# Altium schematic sheet FRU_Programmer.SchDoc: Microcontroller with power supply and interfaces
size A4; Date: 02.03.2021; DrawnBy: PFH; Engineer: PFH; Revision: B; SheetNumber: 1; SheetTotal: 2; Projekt: FRU Programmer for FPGA mezzanine cards (FMC); Website: www.fmchub.com
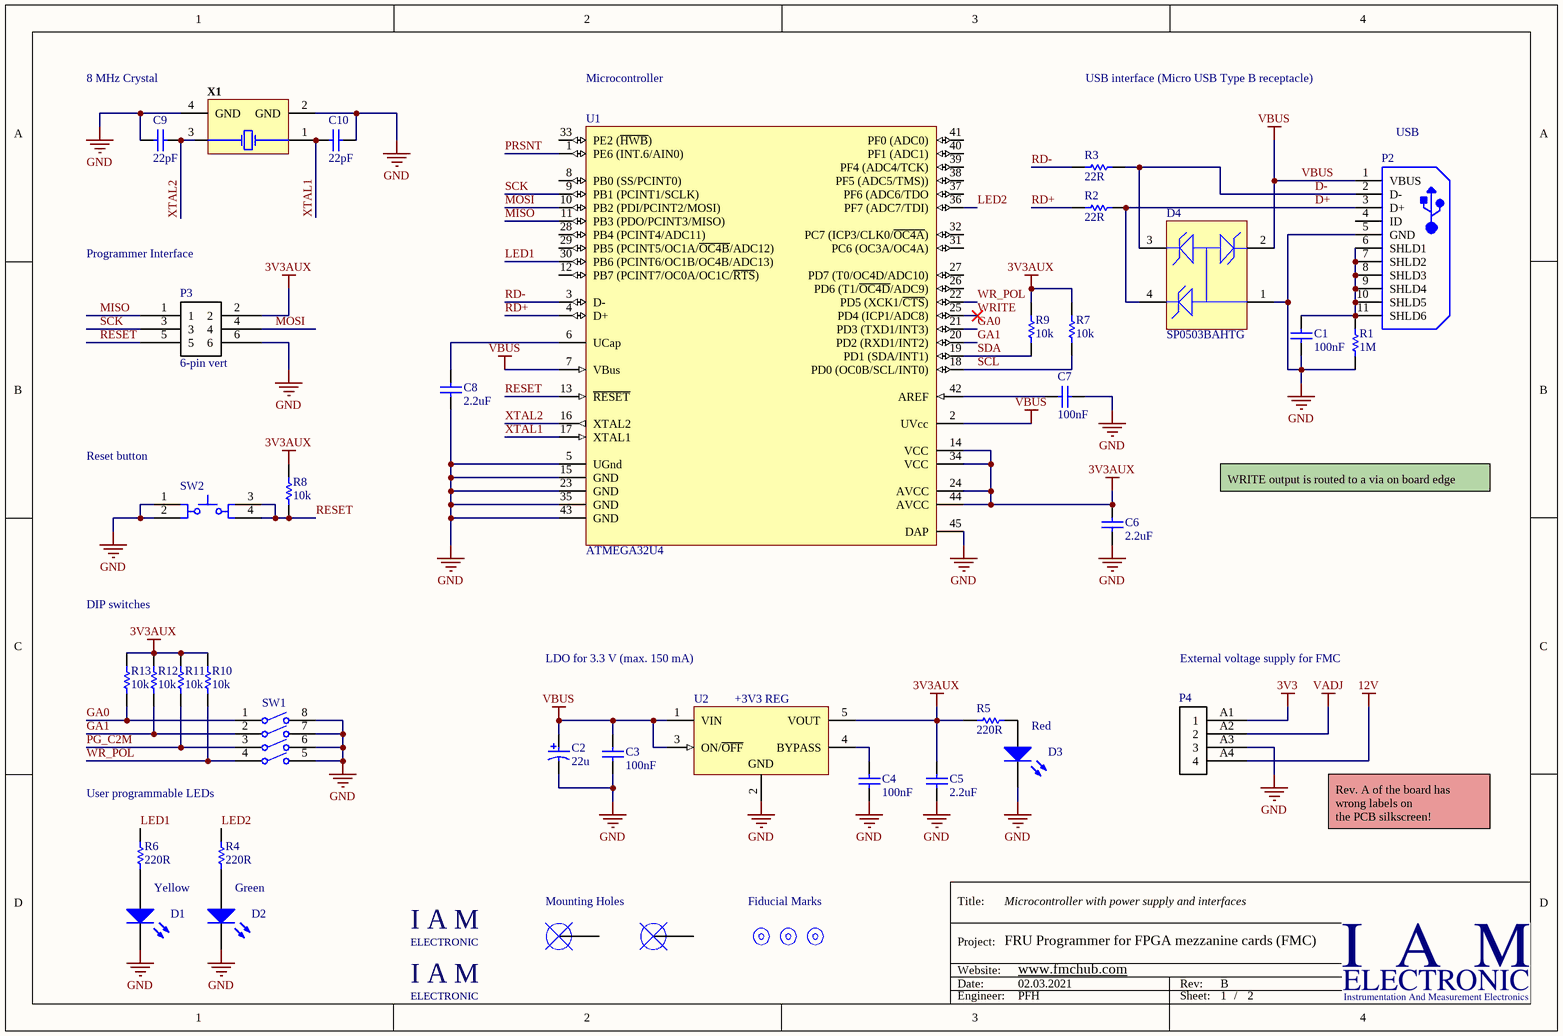
[diagram p0: FRU_Programmer.SchDoc]

## Parts
C1  100nF  [CAPC0603(1608)100_L]
C2  22u  [AVX-TAJ-B-2_L]
C3  100nF  [CAPC0603(1608)100_L]
C4  100nF  [CAPC0603(1608)100_L]
C5  2.2uF  [CAPC0603(1608)100_L]
C6  2.2uF  [CAPC0603(1608)100_L]
C7  100nF  [CAPC0603(1608)100_L]
C8  2.2uF  [CAPC0603(1608)100_L]
C9  22pF  [CAPC0603(1608)100_L]
C10  22pF  [CAPC0603(1608)100_L]
D1  LED Yellow  [0603_A]  (value not drawn)
D2  LED Green  [0603_A]  (value not drawn)
D3  LED Red  [0603_A]  (value not drawn)
D4  SP0503BAHTG  [LFUS-SOT143-4_V]
FM1  1mm  [FIDUCIAL_MARK_ROUND_RING]  (value not drawn)  (no BOM)
FM2  1mm  [FIDUCIAL_MARK_ROUND_RING]  (value not drawn)  (no BOM)
FM3  1mm  [FIDUCIAL_MARK_ROUND_RING]  (value not drawn)  (no BOM)
MH1  2.7mm  [Mounting_Hole_Plated_2.7mm-COVERED]  (value not drawn)  (no BOM)
MH2  2.7mm  [Mounting_Hole_Plated_2.7mm-COVERED]  (value not drawn)  (no BOM)
P2  USB Jack  [FCI-10118193-0001LF-5_V]  (value not drawn)
P3  6-pin vert  [TSM-103-01-T-DV]
P4  PTSM SMT connector  [PTSM-4pol]  (value not drawn)
R1  1M  [RESC1608X55X25NL10T15]
R2  22R  [RESC0603(1608)_L]
R3  22R  [RESC0603(1608)_L]
R4  220R  [RESC1608X55X25NL10T15]
R5  220R  [RESC1608X55X25NL10T15]
R6  220R  [RESC1608X55X25NL10T15]
R7  10k  [RESC1608X55X25NL10T15]
R8  10k  [RESC1608X55X25NL10T15]
R9  10k  [RESC1608X55X25NL10T15]
R10  10k  [RESC1608X55X25NL10T15]
R11  10k  [RESC1608X55X25NL10T15]
R12  10k  [RESC1608X55X25NL10T15]
R13  10k  [RESC1608X55X25NL10T15]
STR1  IAM LOGO  [IAM LOGO - MEDIUM - WWW]  (value not drawn)  (no BOM)
STR2  IAM LOGO  [IAM LOGO - LARGE - WWW]  (value not drawn)  (no BOM)
SW1  DIP switch  [218-4LPST]  (value not drawn)
SW2  Push switch  [ESWI-TL3342F160QG_V]  (value not drawn)
U1  ATMEGA32U4  [44PW_M]
U2  LP2985-33  [DBV0005A_M]  (value not drawn)
X1  8 MHz  [ABRA-ABM3B_V]  (value not drawn)

## Nets
3V3: P4.A1(1)
3V3AUX: C5.1 C6.1 P3.2 R5.2 R7.2 R8.1 R9.2 R10.1 R11.1 R12.1 R13.1 U1.14(VCC) U1.24(AVCC) U1.34(VCC) U1.44(AVCC) U2.5(VOUT)
12V: P4.A4(4)
GND: C1.2 C2.2 C3.2 C4.2 C5.2 C6.2 C7.2 C8.2 C9.1 C10.2 D1.1(K) D2.1(K) D3.1(K) D4.1 P2.5(GND) P3.6 P4.A3(3) R1.1 SW1.5 SW1.6 SW1.7 SW1.8 SW2.1 SW2.2 U1.5(UGnd) U1.15(GND) U1.23(GND) U1.35(GND) U1.43(GND) U1.45(DAP) U2.2(GND) X1.2(GND) X1.4(GND)
VADJ: P4.A2(2)
VBUS: C2.1 C3.1 D4.2 P2.1(VBUS) U1.2(UVcc) U1.7(VBus) U2.1(VIN) U2.3(ON/~{OFF})
D+: D4.4 P2.3(D+) R2.2
D-: D4.3 P2.2(D-) R3.2
GA0: R13.2 SW1.1 U1.21(PD3_(TXD1/INT3))
GA1: R12.2 SW1.2 U1.20(PD2_(RXD1/INT2))
LED1: R6.2 U1.30(PB6_(PCINT6/OC1B/OC4B/ADC13))
LED2: R4.2 U1.36(PF7_(ADC7/TDI))
MISO: P3.1 U1.11(PB3_(PDO/PCINT3/MISO))
MOSI: P3.4 U1.10(PB2_(PDI/PCINT2/MOSI))
PG_C2M: R11.2 SW1.3
PRSNT: U1.1(PE6_(INT.6/AIN0))
RD+: R2.1 U1.4(D+)
RD-: R3.1 U1.3(D-)
RESET: P3.5 R8.2 SW2.3 SW2.4 U1.13(~{RESET})
SCK: P3.3 U1.9(PB1_(PCINT1/SCLK))
SCL: R7.1 U1.18(PD0_(OC0B/SCL/INT0))
SDA: R9.1 U1.19(PD1_(SDA/INT1))
WR_POL: R10.2 SW1.4 U1.22(PD5_(XCK1/~{CTS}))
WRITE: U1.25(PD4_(ICP1/ADC8))
XTAL1: C10.1 U1.17(XTAL1) X1.1(X1)
XTAL2: C9.2 U1.16(XTAL2) X1.3(X2)
NetC1_1: C1.1 P2.6(SHLD1) P2.7(SHLD2) P2.8(SHLD3) P2.9(SHLD4) P2.10(SHLD5) P2.11(SHLD6) R1.2
NetC4_1: C4.1 U2.4(BYPASS)
NetC7_1: C7.1 U1.42(AREF)
NetC8_1: C8.1 U1.6(UCap)
NetD1_2: D1.2(A) R6.1
NetD2_2: D2.2(A) R4.1
NetD3_2: D3.2(A) R5.1

Not connected (* = marked no-connect by the designer): FM1 FD0; FM2 FD0; FM3 FD0; MH1 0; MH2 0; P2 4(ID); U1 8(PB0_(SS/PCINT0)) 12(PB7_(PCINT7/OC0A/OC1C/~{RTS})) 26(PD6_(T1/~{OC4D}/ADC9)) 27(PD7_(T0/OC4D/ADC10)) 28(PB4_(PCINT4/ADC11)) 29(PB5_(PCINT5/OC1A/~{OC4B}/ADC12)) 31(PC6_(OC3A/OC4A)) 32(PC7_(ICP3/CLK0/~{OC4A})) 33(PE2_(~{HWB})) 37(PF6_(ADC6/TDO) 38(PF5_(ADC5/TMS))) 39(PF4_(ADC4/TCK)) 40(PF1_(ADC1)) 41(PF0_(ADC0))

## Notes on the sheet
- 8 MHz Crystal
- Microcontroller
- USB interface (Micro USB Type B receptacle)
- (near P2) USB
- Programmer Interface
- (near SW2) Reset button
- WRITE output is routed to a via on board edge
- DIP switches
- LDO for 3.3 V (max. 150 mA)
- (near U2) +3V3 REG
- External voltage supply for FMC
- Red
- User programmable LEDs
- Rev. A of the board has
  wrong labels on
  the PCB silkscreen!
- Yellow
- Green
- Mounting Holes
- Fiducial Marks
- Title:
- Project:
- Date:
- Website:
- Rev:
- Engineer:
- Sheet:
- /
- (in symbol IAM_LOGO) I A M; ELECTRONIC

## Library data of the parts
C1 C3 C7 = CMP-1035-02591-1: CAP 100nF, 0603 (1608 Metric); Part: C0603C104M4RAC7411; Manufacturer: KEMET; Rated Voltage: 50 V; Tolerance: Â±5%; Case-Metric: 1608; Case-EIA: 0603; Max Thickness: 1 mm; Technology: SMT; Value: 100nF
C2 = CMP-2100-03689-1: Standard Tantalum, 22 uF, +/- 10%, 16 V, -55 to 125 degC, 2-Pin SMD (1210), RoHS, Tape and Reel; Manufacturer: AVX; Part: TAJB226K016RNJ; Leakage Current: 3.5uA; Dissipation Factor: 6%; Voltage Rating (DC): 16V; Capacitance: 22uF; ESR (Equivalent Series Resistance): 2.3Ohm; Polarity: Polar; Package Quantity: 1; Tolerance: 10%; Number of Pins: 2; Manufacturer URL: http://www.avx.com/; Height - Seated (Max): 0.083inch; Case Code (Imperial): 1210; Package Reference: TAJ-B-2; Height: 1.9mm; Depth: 2.8mm; Packaging: TapeandReel; Termination: SMD/SMT; Case/Package: 1210; Lead Free: LeadFree; Min Operating Temperature: -55degC; RoHSCompliant: True; Dielectric Material: Tantalum; Case Code (Metric): 3528; Width: 2.8mm; Datasheet URL: http://datasheets.avx.com/TAJ.pdf; Radiation Hardening: No; Package Description: 2-Pin Surface Mount Device, Body 3.5 x 2.85 mm; Length: 3.5mm; Voltage Rating: 16V; Datasheet Version: 42401.0; Max Operating Temperature: 125degC; REACH SVHC: NoSVHC; Voltage: 16V
C4 = CMP-1035-02591-1: CAP 100nF, 0603 (1608 Metric); Manufacturer: KEMET; Part: C0603C104M4RAC7411; Rated Voltage: 50 V; Tolerance: Â±5%; Case-Metric: 1608; Case-EIA: 0603; Max Thickness: 1 mm; Technology: SMT; Value: 100nF
C5 C6 = CMP-1035-02591-1: CAP 2.2uF, 0603 (1608 Metric); Part: C0603C225K4PACTU; Manufacturer: KEMET; Rated Voltage: 50 V; Tolerance: Â±5%; Case-Metric: 1608; Case-EIA: 0603; Value: 100nF; Max Thickness: 1 mm; Technology: SMT
C8 = CMP-1035-02591-1: CAP 2.2uF, 0603 (1608 Metric); Manufacturer: KEMET; Part: C0603C225K4PACTU; Rated Voltage: 50 V; Tolerance: Â±5%; Case-Metric: 1608; Case-EIA: 0603; Value: 100nF; Max Thickness: 1 mm; Technology: SMT
C9 C10 = CMP-1035-02591-1: CAP 22pF, 0603 (1608 Metric); Part: CC0603JRNPO9BN220; Manufacturer: Yageo; Rated Voltage: 50 V; Tolerance: Â±5%; Case-Metric: 1608; Case-EIA: 0603; Value: 100nF; Max Thickness: 1 mm; Technology: SMT; Manufacturer2: KEMET; Part2: CBR06C220J5GAC
D1 = CMP-1426-00006-1: LED 0603, 2V, Yellow; PartNumber: 150060YS75000; Manufacturer: Wuerth Elektronik; ComponentLink2URL: http://katalog.we-online.com/led/datasheet/150060VS75000.pdf; ComponentLink1Description: Manufacturer URL; PackageReference: 0603_A; ComponentLink2Description: Datasheet; ComponentLink1URL: http://www.we-online.com; Color: Yellow; Part: 150060YS75000
D2 = CMP-1426-00006-1: LED 0603, 2V, Green; PartNumber: 150060VS75000; Manufacturer: Wuerth Elektronik; Color: Bright Green; ComponentLink2URL: http://katalog.we-online.com/led/datasheet/150060VS75000.pdf; ComponentLink1Description: Manufacturer URL; PackageReference: 0603_A; ComponentLink2Description: Datasheet; ComponentLink1URL: http://www.we-online.com; Part: 150060VS75000
D3 = CMP-1426-00006-1: LED 0603, 2V, Red; PartNumber: 150060RS75000; Manufacturer: Wuerth Elektronik; ComponentLink2URL: http://katalog.we-online.com/led/datasheet/150060VS75000.pdf; ComponentLink1Description: Manufacturer URL; PackageReference: 0603_A; ComponentLink2Description: Datasheet; ComponentLink1URL: http://www.we-online.com; Color: Red; Part: 150060RS75000
D4 = CMP-2000-05191-1: TVS Diode Array, 30 pF, 30 KV, -40 to 85 degC, 4-Pin SOT143, RoHS, Tape and Reel; Manufacturer: Littelfuse; Direction Type: Uni-Directional; Product Height (mm): 1.05mm; Leakage Current (Max): 0.1uA; Clamping Voltage (Max): 8V; Reverse Stand-off Voltage: 5.5(Min)V; Configuration: Triple; Working Voltage: 5.5V; Product Length (mm): 3.04mm; Working Voltage (Max): 5.5V(Min); Capacitance Value: 30pF; Rad Hardened: No; Number of Elements: 3; Product Depth (mm): 1.4mm; Operating Temperature Max Deg. C: 85C; Suppressor Type: TVS; Operating Temperature Min Deg. C: -40C; Operating Temp Range: -40Cto85C; Mounting: SurfaceMount; Package / Case: SOT-143; Datasheet Version: Dec-13; Package Type: SOT-143; Packaging: TapeandReel; Pin Count: 3+Tab; Operating Temperature Classification: Industrial; Datasheet URL: https://datasheet.ciiva.com/15143/getdatasheetpartid-116020-15143550.pdf; Manufacturer URL: http://www.littelfuse.com/; Leakage Current: 0.1uA; Mounting Style: SurfaceMount; Clamping Voltage: 8V; Polarity: Uni-Directional; Part: SP0503BAHTG
FM1-FM3 = Fiducial_Mark: Fiducial mark, width 1mm, clearance 3mm; Width: 1 mm; Clearance: 3 mm
MH1 MH2 = Mounting_Hole_2.7mm: Mounting hole, hole size 2.7mm; Hole radius: 2.7 mm; Diameter (plated): *; Keep out (radius): *; Plated: *
P2 = CMP-2000-05119-1: Micro USB B Type Receptacle, -55 to 85 degC, 5-Pin SMD, RoHS, Tape and Reel; Manufacturer: FCI; Part: 10118193-0001LF; Insulation Resistance: 1000MOhms; Gender: Female; Current Rating: 1.8A; Number of Contacts: 5Contact; Connector Type: MicroUSBTypeBreceptacle; Mounting Angle: Right; Datasheet Version: Rev. C, 05/2015; Packaging: Reel; Product Category: USBConnectors; Standard: USB2.0; Factory Pack Quantity: 1200; Operating Temperature Range: -55Cto+85C; Termination Style: SMD/SMT; Datasheet URL: http://datasheet.octopart.com/10118193-0001LF-FCI-datasheet-55953155.pdf; Contact Material: CopperAlloy; RoHS: Details; Contact Plating: Gold; Flammability Rating: UL94V-0; Manufacturer URL: http://www.fci.com/; Brand: FCI; Product: MicroUSBTypeBConnectors; Color: Black
P3 = TSM-103-01-T-DV: .100" (2.54 mm) pitch 6 pin (dual row) header, 0.38" (9.65 mm) total height, SMT; Manufacturer: Samtec; Part: TSM-103-01-T-DV
P4 = PC-PTSM-4pol: Phoenix Contact PTSM SMT connector; Part: 1814650; Manufacturer: Phoenix Contact
R1 = CMP-2000-05022-1: Resistor, 1 MOhm, 0603 (1608 Metric); Manufacturer: Yageo; Part: RC0603JR-071ML; Resistance: 10kOhms; Voltage Rating: 50V; Temperature Coefficient: 100PPM/C; Power Rating: 100mW; Tolerance: 5%; Package Reference: 603; Series: RC; Case Code - mm: 1608; Packaging: Reel; Datasheet URL: http://www.farnell.com/datasheets/443971.pdf; Datasheet Version: Rev. 4, 04/2009; Operating Temperature Range: -55Cto+155C; Product: ThickFilmResistorsGeneralPurpose; Package Description: 2-Pin Surface Mount Device, Body 1.6 x 0.8 mm; Manufacturer URL: http://www.yageo.com/; Case Code - in: 0603; Termination Style: SMD/SMT
R2 R3 = CMP-1012-00034-1: 22R 0.1W 5% 0603 (1608 Metric)  SMD; Part: RC0603FR-0722RL; Manufacturer: Yageo; Value: 22.00 Ohm; Case-EIA: 0603; Case-Metric: 1608; Technology: SMT; Power: 0.1 W; Tolerance: 5 %
R4-R6 = CMP-1659-00018-1: Resistors, 220 Ohm, +/- 1%, 0603 (1608 Metric); Part: RC0603FR-07220RL; Manufacturer: Yageo; ComponentLink1URL: http://www.yageo.com/; ComponentLink1Description: Manufacturer URL; PackageDescription: 2-Pin Surface Mount Device, Body 1.6 x 0.8 mm; RoHSCompliant: false; ComponentLink2Description: Datasheet; DatasheetVersion: Rev. 4, 04/2009; PackageReference: 0603; ComponentLink2URL: https://datasheet.ciiva.com/11808/0900766b80f96399-11808136.pdf
R7-R13 = CMP-2000-05022-1: Resistor, 10 KOhm, 0603 (1608 Metric); Manufacturer: Walsin; Part: WR06X1002FTL; Resistance: 10kOhms; Voltage Rating: 50V; Temperature Coefficient: 100PPM/C; Power Rating: 100mW; Tolerance: 5%; Package Reference: 603; Series: RC; Case Code - mm: 1608; Packaging: Reel; Datasheet URL: http://www.farnell.com/datasheets/443971.pdf; Datasheet Version: Rev. 4, 04/2009; Operating Temperature Range: -55Cto+155C; Product: ThickFilmResistorsGeneralPurpose; Package Description: 2-Pin Surface Mount Device, Body 1.6 x 0.8 mm; Manufacturer URL: http://www.yageo.com/; Case Code - in: 0603; Termination Style: SMD/SMT
STR1 STR2 = IAM_LOGO: I A M E L E C T R O N I C - Logo; Layer: Top Overlay; Manufacturer: IAM ELECTRONIC; Part: Logo
SW1 = 218-4LPST: 4 channel DIP switch; Manufacturer: CTS Electronic Components; Part: 218-4LPST
SW2 = CMP-1696-00003-1: Switch, Tactile, SPST-NO, 50 mA, 12 V, 4-Pin SMD, RoHS, Tape and Reel; Part: TL3342F160QG; Manufacturer: E-Switch; Voltage Rating (DC): 50 V; Tolerance: 20%; Case\Package: Radial; Capacitance: 4.7 uF; Max Operating Temperature: 85 degC; REACH SVHC: No SVHC; Package Quantity: 200; Voltage Rating: 50 V; ComponentLink1Description: Manufacturer URL; ComponentLink2URL: http://spec_sheets.e-switch.com/specs/P010632.pdf; ComponentLink2Description: Datasheet; Height: 11 mm; Lead Pitch: 2 mm; RoHSCompliant: true; Radiation Hardening: No; Pins: 2; Length: 11 mm; DatasheetVersion: Rev. I, 12/2010; PackageReference: TL3342F160QG; ComponentLink1URL: http://www.e-switch.ch/en/; PackageDescription: 4-Pin Surface Mount Device, Body 5 x 5 mm, Pitch 6.3 mm; Mount: Through Hole; Diameter: 5 mm; Packaging: Bulk; Min Operating Temperature: -40 degC; Width: 0 inch
U1 = CMP-0095-00166-2: 8-bit AVR Microcontroller, 2.7-5.5V, 16MHz, 32KB Flash, 1KB EEPROM, 2.5KB SRAM, USB Controller, 44-pin QFN, Industrial Grade (-40°C to 85°C), Ext Osc; Part: ATMEGA32U4-MU; Manufacturer: Microchip; PackageVersion: revG, Sep-2009; PackageReference: 44PW; ComponentLink1URL: http://www.atmel.com/; PackageDescription: 44-Pin Quad Flat No-Lead Package, 7 x 7 mm Body, 0.5 mm Pitch (QFN); ComponentLink3Description: ATmega16U4 ATmega32U4 Summary; RevisionNote: DatasheetVersion, PackageVersion & PCB updated. URLs added.; ComponentLink2Description: ATmega16U4/32U4 Datasheet; ComponentLink1Description: Manufacturer URL; ComponentLink3URL: http://www.atmel.com/dyn/resources/prod_documents/7766S.pdf; DatasheetVersion: revF, Nov-2010; ComponentLink2URL: http://www.atmel.com/dyn/resources/prod_documents/doc7766.pdf; Code_JEDEC: MO-220-VKKD-1
U2 = CMP-0758-00080-2: Single Output Low Noise LDO, 150 mA, Fixed 3.3 V Output, 1.5% Tolerance, 2.2 to 16 V Input, Low IQ, 5-Pin SOT-23 (DBV), -40 to 125 degC, Green (RoHS & no Sb/Br), Tape and Reel; Manufacturer: Texas Instruments; PartNumber: LP2985-33DBVR; Vdo (Typ) (mV): 280; Accuracy (%): 1.5; Output Options: Fixed Output; Fixed Output Options (V): 3.3; Iout (Max) (A): 0.15; Iq (Typ) (mA): 0.85; ComponentLink3Description: Package Specification; Packing: Tape and Reel; ComponentLink3URL: http://www.ti.com/litv/pdf/mpds018j; Vin (V): 2.2 to 16; Mounting Technology: Surface Mount; ComponentLink1URL: http://www.ti.com/; PackageReference: DBV0005A; ComponentLink2URL: http://www.ti.com/lit/ds/symlink/lp2985-50.pdf; RoHS: TRUE; ComponentLink2Description: Datasheet; PackageVersion: 4073253-4/L; Operating Temperature Range (degC): -40 to 125; DatasheetVersion: SLVS522N; ComponentLink1Description: Manufacturer URL; PackageDescription: 5-Pin Plastic Small Outline, Body 2.9 x 1.6 mm, Pitch 0.95 mm; Part: LP2985-33DBVR
X1 = CMP-2000-05730-1: Ceramic Crystal, 8 MHz, +/- 10 ppm, -10 to 60 degC, 4-Pin SMD, RoHS, Tape and Reel; Manufacturer: Abracon-LLC; Part: ABM3B-8.000MHZ-10-1-U-T; ESR (Equivalent Series Resistance): 200Ohm; Frequency: 8MHz; Frequency Tolerance: ±10ppm; Operating Mode: Fundamental; Load Capacitance: 10pF; Ratings: -; Mounting Type: SurfaceMount; Type: MHzCrystal; Height: 0.043"(1.10mm); Operating Temperature: -10°C~60°C; Package / Case: 4-SMD,NoLead(DFN,LCC); Family: Crystals; Category: CrystalsandOscillators; Frequency Stability: ±10ppm; Mounting Technology: SurfaceMount; Datasheet URL: http://www.abracon.com/Resonators/abm3b.pdf; Datasheet Version: 08/2015; Manufacturer URL: http://www.abracon.com/; Series: ABM3B; Packaging: Tape&amp;Reel(TR); Package Reference: ABM3B; Package Description: 4-Pin Surface Mount Device, Body 5 x 3.2 mm; Size / Dimension: 0.197"Lx0.126"W(5.00mmx3.20mm)